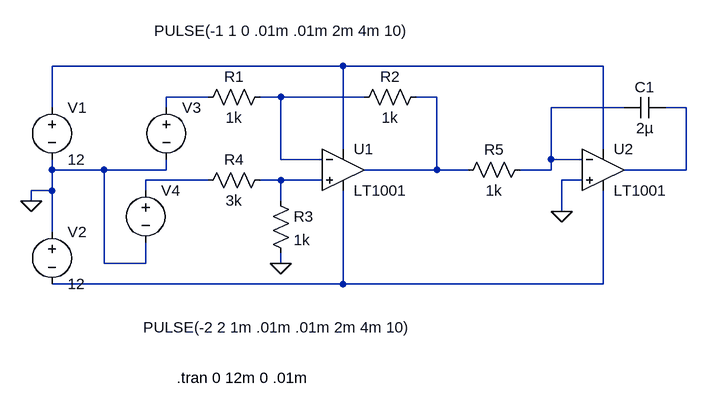
[diagram p0: schematic problema_op1.asc]
problema_op1.asc, the LTspice schematic file:
Version 4
SHEET 1 880 680
WIRE 144 0 -304 0
WIRE 544 0 144 0
WIRE -64 48 -128 48
WIRE 48 48 16 48
WIRE 176 48 48 48
WIRE 288 48 256 48
WIRE -304 64 -304 0
WIRE -128 64 -128 48
WIRE 576 64 464 64
WIRE 672 64 640 64
WIRE 144 128 144 0
WIRE 544 128 544 0
WIRE 48 144 48 48
WIRE 112 144 48 144
WIRE 464 144 464 64
WIRE 512 144 464 144
WIRE -304 160 -304 144
WIRE -224 160 -304 160
WIRE -128 160 -128 144
WIRE -128 160 -224 160
WIRE 288 160 288 48
WIRE 288 160 176 160
WIRE 336 160 288 160
WIRE 464 160 464 144
WIRE 464 160 416 160
WIRE 672 160 672 64
WIRE 672 160 576 160
WIRE -64 176 -160 176
WIRE 48 176 16 176
WIRE 112 176 48 176
WIRE 512 176 480 176
WIRE -304 192 -304 160
WIRE -304 192 -336 192
WIRE -160 192 -160 176
WIRE -336 208 -336 192
WIRE 48 208 48 176
WIRE 480 224 480 176
WIRE -304 256 -304 192
WIRE -224 304 -224 160
WIRE -160 304 -160 272
WIRE -160 304 -224 304
WIRE 48 304 48 288
WIRE 144 336 144 192
WIRE 144 336 -304 336
WIRE 544 336 544 192
WIRE 544 336 144 336
FLAG -336 208 0
FLAG 48 304 0
FLAG 480 224 0
SYMBOL Opamps\\LT1001 144 96 R0
SYMATTR InstName U1
SYMBOL Opamps\\LT1001 544 96 R0
SYMATTR InstName U2
SYMBOL voltage -304 48 R0
WINDOW 123 0 0 Left 2
WINDOW 39 0 0 Left 2
SYMATTR InstName V1
SYMATTR Value 12
SYMBOL voltage -304 240 R0
WINDOW 123 0 0 Left 2
WINDOW 39 0 0 Left 2
SYMATTR InstName V2
SYMATTR Value 12
SYMBOL res 32 32 R90
WINDOW 0 0 56 VBottom 2
WINDOW 3 32 56 VTop 2
SYMATTR InstName R1
SYMATTR Value 1k
SYMBOL res 272 32 R90
WINDOW 0 0 56 VBottom 2
WINDOW 3 32 56 VTop 2
SYMATTR InstName R2
SYMATTR Value 1k
SYMBOL res 32 192 R0
SYMATTR InstName R3
SYMATTR Value 1k
SYMBOL res 32 160 R90
WINDOW 0 0 56 VBottom 2
WINDOW 3 32 56 VTop 2
SYMATTR InstName R4
SYMATTR Value 3k
SYMBOL res 432 144 R90
WINDOW 0 0 56 VBottom 2
WINDOW 3 32 56 VTop 2
SYMATTR InstName R5
SYMATTR Value 1k
SYMBOL cap 640 48 R90
WINDOW 0 0 32 VBottom 2
WINDOW 3 32 32 VTop 2
SYMATTR InstName C1
SYMATTR Value 2µ
SYMBOL voltage -128 48 R0
WINDOW 3 -19 -102 Left 2
WINDOW 123 0 0 Left 2
WINDOW 39 0 0 Left 2
SYMATTR Value PULSE(-1 1 0 .01m .01m 2m 4m 10)
SYMATTR InstName V3
SYMBOL voltage -160 176 R0
WINDOW 3 -4 227 Left 2
WINDOW 123 0 0 Left 2
WINDOW 39 0 0 Left 2
SYMATTR Value PULSE(-2 2 1m .01m .01m 2m 4m 10)
SYMATTR InstName V4
TEXT -112 480 Left 2 !.tran 0 12m 0 .01m

The netlist it stands for:
* problema_op1.asc
XU1 N008 N003 N001 N009 N004 LT1001  ; pins In+ In- V+ V- OUT
XU2 0 N005 N001 N009 N006 LT1001  ; pins In+ In- V+ V- OUT
V1 N001 0 12
V2 0 N009 12
R1 N003 N002 1k
R2 N004 N003 1k
R3 N008 0 1k
R4 N008 N007 3k
R5 N005 N004 1k
C1 N006 N005 2µ
V3 N002 0 PULSE(-1 1 0 .01m .01m 2m 4m 10)
V4 N007 0 PULSE(-2 2 1m .01m .01m 2m 4m 10)
.tran 0 12m 0 .01m
.lib LTC.lib
.backanno
.end